# Altium project sensor_pcb_v0.1.PrjPcb
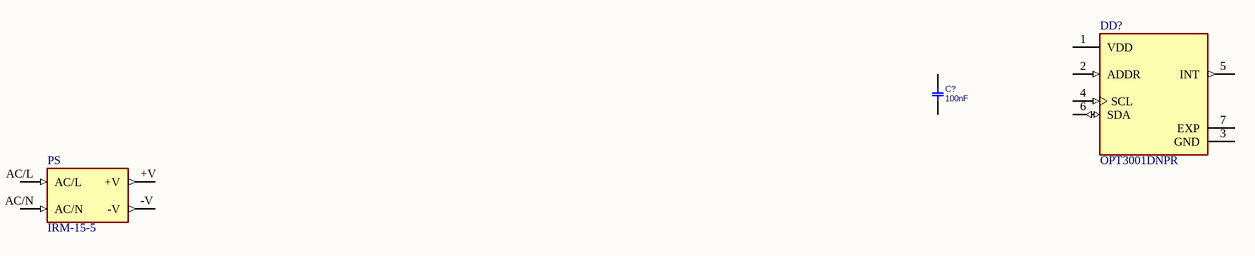
[diagram p0: sensor_pcb_v0.1.SchDoc]
1 sheet, 3 parts. Net scope: global (net labels, ports and power ports of the same name join across sheets).
Board files: sensor_pcb_v0.1.PcbDoc, pcb cover.PcbDoc

## Sheet sensor_pcb_v0.1.SchDoc
size A4

### Parts
C?  100nF  [C0603]
DD?  OPT3001DNPR  [SON65P200X200X65-7N]
PS  IRM-15-5  [CONV_IRM-15-5]

### Nets

Not connected (* = marked no-connect by the designer): C? 1 2; DD? 1(VDD) 2(ADDR) 3(GND) 4(SCL) 5(INT) 6(SDA) 7(EXP); PS +V -V AC/L AC/N

### Library data of the parts
C? = CAP_SMD_MLCC: CAP, SMD, MLCC; PARAM: 50V; DESC: CAP, MLCC, 1nF, 50V, C0G, 10%, 0402; MANF_P#: MANF_PART#; MANF: Murata; PARAM2: C0G, 10%; PRICE: 100= 1$; ASSEMBLY: ASSEMBLY; VALUE: 100nF
DD? = OPT3001DNPR: Optical Sensor Ambient 550nm IÂ²C 6-UDFN Exposed Pad <a href="https://snapeda.com/parts/OPT3001DNPR/Texas%20Instruments/view-part/?ref=eda">Buy Part</a>; Price: None; Package: None; Availability: Unavailable; MP: OPT3001DNPR; Value: *
PS = IRM-15-5: Enclosed AC DC Converters 1 Uitgang 5V 3A 85 ~ 264 VAC, 120 ~ 370 VDC Input; MF: MEAN WELL; SnapEDA_Link: https://www.snapeda.com/parts/IRM-15-5/MEAN%20WELL%20USA%20Inc./view-part/275136/?ref=snap; MP: IRM-15-5; Package: DIP-4 Mean Well; Value: *; Digi-Key_Purchase_URL: https://www.digikey.com/product-detail/en/mean-well-usa-inc/IRM-15-5/1866-3037-ND/7704662?utm_source=snapeda&utm_medium=aggregator&utm_campaign=symbol; Digi-Key_Part_Number: 1866-3037-ND